# Altium schematic sheet TP_IHM_7SEG_DRIVERS.SchDoc: 7SEG DRIVER
size A3
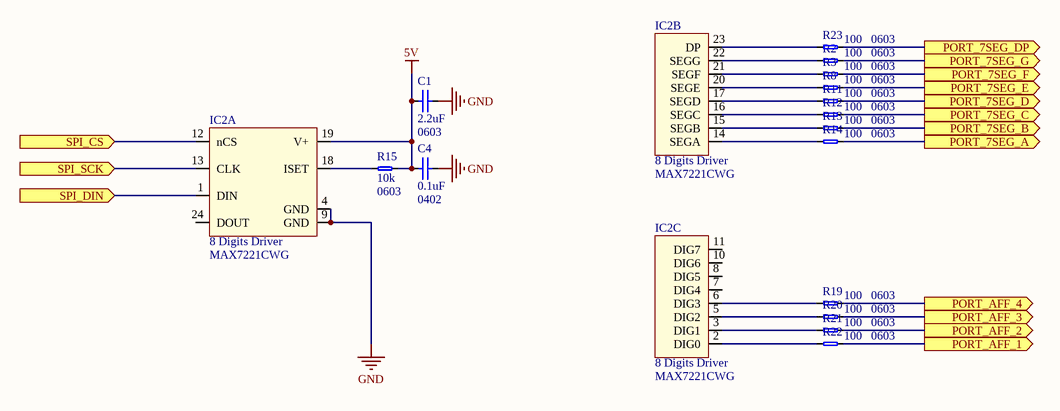
[diagram p0: TP_IHM_7SEG_DRIVERS.SchDoc]

## Parts
C1  value 2.2uF  Package: 0603  [0603_CAP_LD]  (hidden comment: CerCap)
C4  value 0.1uF  Package: 0402  [0603_CAP_LD]  (hidden comment: CerCap)
IC2  8 Digits Driver  [MAX7221CWG]  (parts A,B,C of 3)
R2  value 100  Package: 0603  [0603_RES_LD]  (hidden comment: Resistor)
R3  value 100  Package: 0603  [0603_RES_LD]  (hidden comment: Resistor)
R8  value 100  Package: 0603  [0603_RES_LD]  (hidden comment: Resistor)
R11  value 100  Package: 0603  [0603_RES_LD]  (hidden comment: Resistor)
R12  value 100  Package: 0603  [0603_RES_LD]  (hidden comment: Resistor)
R13  value 100  Package: 0603  [0603_RES_LD]  (hidden comment: Resistor)
R14  value 100  Package: 0603  [0603_RES_LD]  (hidden comment: Resistor)
R15  value 10k  Package: 0603  [0603_RES_LD]  (hidden comment: Resistor)
R19  value 100  Package: 0603  [0603_RES_LD]  (hidden comment: Resistor)
R20  value 100  Package: 0603  [0603_RES_LD]  (hidden comment: Resistor)
R21  value 100  Package: 0603  [0603_RES_LD]  (hidden comment: Resistor)
R22  value 100  Package: 0603  [0603_RES_LD]  (hidden comment: Resistor)
R23  value 100  Package: 0603  [0603_RES_LD]  (hidden comment: Resistor)

## Ports
PORT_7SEG_A (out), PORT_7SEG_B (out), PORT_7SEG_C (out), PORT_7SEG_D (out), PORT_7SEG_DP (out), PORT_7SEG_E (out), PORT_7SEG_F (out), PORT_7SEG_G (out), PORT_AFF_1 (out), PORT_AFF_2 (out), PORT_AFF_3 (out), PORT_AFF_4 (out), SPI_CS (in), SPI_DIN (in), SPI_SCK (in)

## Nets
5V: C1.1 C4.2 IC2.19(V+) R15.1
GND: C1.2 C4.1 IC2.4(GND) IC2.9(GND)
PORT_7SEG_A: R14.1 ; port PORT_7SEG_A
PORT_7SEG_B: R13.1 ; port PORT_7SEG_B
PORT_7SEG_C: R12.1 ; port PORT_7SEG_C
PORT_7SEG_D: R11.1 ; port PORT_7SEG_D
PORT_7SEG_DP: R23.1 ; port PORT_7SEG_DP
PORT_7SEG_E: R8.1 ; port PORT_7SEG_E
PORT_7SEG_F: R3.1 ; port PORT_7SEG_F
PORT_7SEG_G: R2.1 ; port PORT_7SEG_G
PORT_AFF_1: R22.1 ; port PORT_AFF_1
PORT_AFF_2: R21.1 ; port PORT_AFF_2
PORT_AFF_3: R20.1 ; port PORT_AFF_3
PORT_AFF_4: R19.1 ; port PORT_AFF_4
SPI_CS: IC2.12(nCS) ; port SPI_CS
SPI_DIN: IC2.1(DIN) ; port SPI_DIN
SPI_SCK: IC2.13(CLK) ; port SPI_SCK
NetIC2_2: IC2.2(DIG0) R22.2
NetIC2_3: IC2.3(DIG1) R21.2
NetIC2_5: IC2.5(DIG2) R20.2
NetIC2_6: IC2.6(DIG3) R19.2
NetIC2_14: IC2.14(SEGA) R14.2
NetIC2_15: IC2.15(SEGB) R13.2
NetIC2_16: IC2.16(SEGC) R12.2
NetIC2_17: IC2.17(SEGD) R11.2
NetIC2_18: IC2.18(ISET) R15.2
NetIC2_20: IC2.20(SEGE) R8.2
NetIC2_21: IC2.21(SEGF) R3.2
NetIC2_22: IC2.22(SEGG) R2.2
NetIC2_23: IC2.23(DP) R23.2

Not connected (* = marked no-connect by the designer): IC2 7(DIG4) 8(DIG5) 10(DIG6) 11(DIG7) 24(DOUT)

## Notes on the sheet
- Title
- Size:
- Date:
- A3
- Number:
- Time:
- Revision:
- Sheet
- of
- File:

## Library data of the parts
C1 C4 = CerCap: Ceramic Capacitor; Type: *; Voltage/Power: *
IC2 = MAX7221: MAX7221 8 Digit 7 Segments Display; Reference: MAX7221CWG
R2 R3 R8 R11-R15 R19-R23 = Resistor: Precision: *